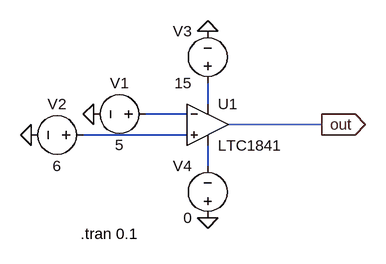
[diagram p0: schematic Draft3.asc]
Draft3.asc, the LTspice schematic file:
Version 4
SHEET 1 880 680
WIRE 176 144 176 112
WIRE 144 160 80 160
WIRE 352 176 208 176
WIRE 144 192 -16 192
WIRE 176 240 176 208
FLAG 0 160 0
FLAG -96 192 0
FLAG 176 320 0
FLAG 176 32 0
FLAG 352 176 out
IOPIN 352 176 Out
SYMBOL Comparators\\LTC1841 176 176 R0
SYMATTR InstName U1
SYMBOL voltage 96 160 R90
WINDOW 0 -32 56 VBottom 2
WINDOW 3 32 56 VTop 2
WINDOW 123 0 0 Left 0
WINDOW 39 0 0 Left 0
SYMATTR InstName V1
SYMATTR Value 5
SYMBOL voltage 0 192 R90
WINDOW 0 -32 56 VBottom 2
WINDOW 3 32 56 VTop 2
WINDOW 123 0 0 Left 0
WINDOW 39 0 0 Left 0
SYMATTR InstName V2
SYMATTR Value 6
SYMBOL voltage 176 128 R180
WINDOW 0 24 96 Left 2
WINDOW 3 24 16 Left 2
WINDOW 123 0 0 Left 0
WINDOW 39 0 0 Left 0
SYMATTR InstName V3
SYMATTR Value 15
SYMBOL voltage 176 336 R180
WINDOW 0 24 96 Left 2
WINDOW 3 24 16 Left 2
WINDOW 123 0 0 Left 0
WINDOW 39 0 0 Left 0
SYMATTR InstName V4
SYMATTR Value 0
TEXT -20 344 Left 2 !.tran 0.1

The netlist it stands for:
* Draft3.asc
* U1: LTC1841 (symbol Comparators\LTC1841 not available, pins judged from their places): In+=N003 In-=N002 V+=N001 V-=N004 OUT=out
V1 N002 0 5
V2 N003 0 6
V3 N001 0 15
V4 0 N004 0
.tran 0.1
.backanno
.end